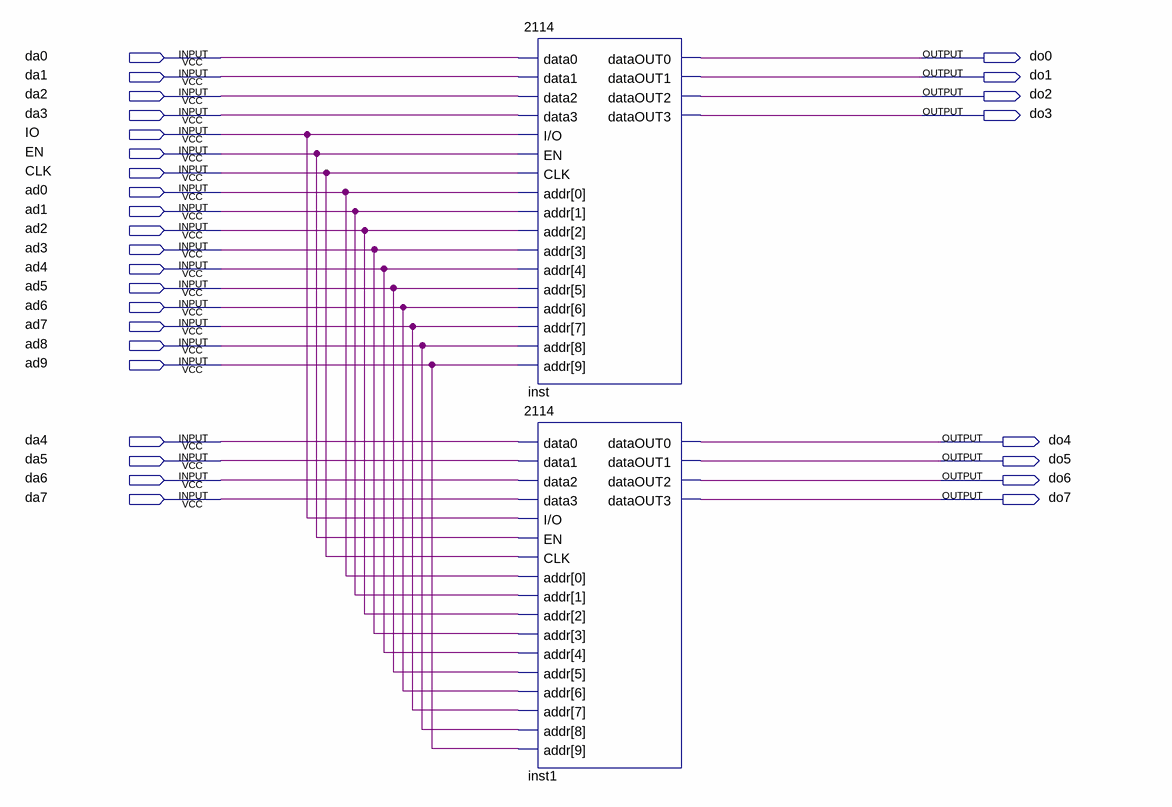
[diagram p0: schematic sheet]
// Quartus schematic COADEXP5.bdf as structural Verilog: 2 symbols, 29 pins
module COADEXP5 (
  input  da0,
  input  da1,
  input  da2,
  input  da3,
  input  IO,
  input  EN,
  input  CLK,
  input  ad0,
  input  ad1,
  input  ad2,
  input  ad3,
  input  ad4,
  input  ad5,
  input  ad6,
  input  ad7,
  input  ad8,
  input  ad9,
  input  da4,
  input  da5,
  input  da6,
  input  da7,
  output do0,
  output do1,
  output do2,
  output do3,
  output do4,
  output do5,
  output do6,
  output do7
);

  \2114  inst (
    .data0(da0), .data1(da1), .data2(da2), .data3(da3), .\I/O (IO), .EN(EN), .CLK(CLK),
    .addr({ad9, ad8, ad7, ad6, ad5, ad4, ad3, ad2, ad1, ad0}), .dataOUT0(do0), .dataOUT1(do1),
    .dataOUT2(do2), .dataOUT3(do3));
  \2114  inst1 (
    .data0(da4), .data1(da5), .data2(da6), .data3(da7), .\I/O (IO), .EN(EN), .CLK(CLK),
    .addr({ad9, ad8, ad7, ad6, ad5, ad4, ad3, ad2, ad1, ad0}), .dataOUT0(do4), .dataOUT1(do5),
    .dataOUT2(do6), .dataOUT3(do7));
endmodule
